# EAGLE design mbmc_single_board_cpu (EAGLE 9.5.2)
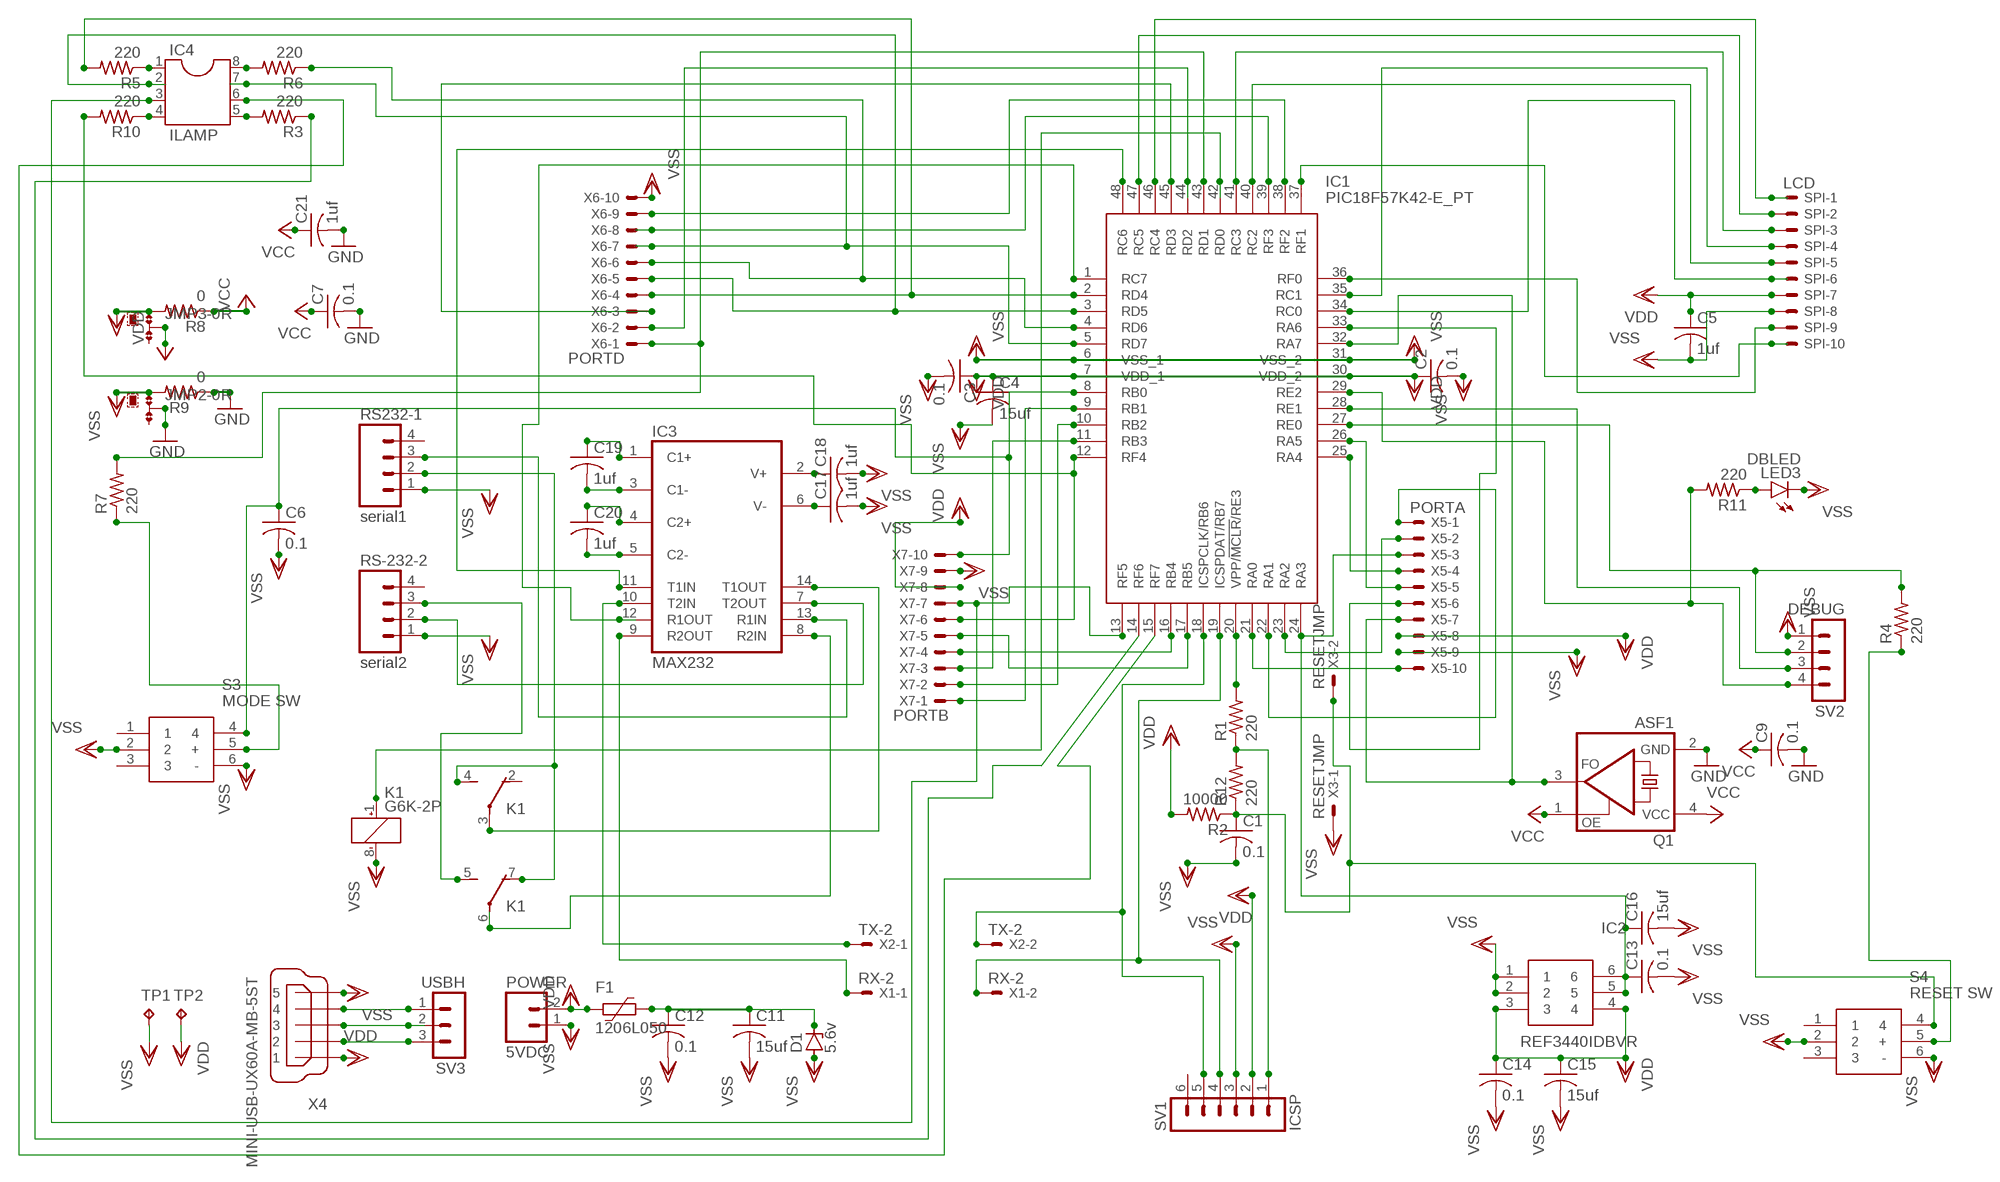
[diagram p0: schematic, sheet 1]

## Parts
C1  0.1  C-USC1206  [C1206]
C2  0.1  C-USC1206  [C1206]
C3  0.1  C-USC1206  [C1206]
C4  15uf  C-USC1206  [C1206]
C5  1uf  C-USC0805  [C0805]
C6  0.1  C-USC1206  [C1206]
C7  0.1  C-USC1206  [C1206]
C9  0.1  C-USC1206  [C1206]
C11  15uf  C-USC1206  [C1206]
C12  0.1  C-USC1206  [C1206]
C13  0.1  C-USC1206  [C1206]
C14  0.1  C-USC1206  [C1206]
C15  15uf  C-USC1206  [C1206]
C16  15uf  C-USC1206  [C1206]
C17  1uf  C-USC0805  [C0805]
C18  1uf  C-USC0805  [C0805]
C19  1uf  C-USC0805  [C0805]
C20  1uf  C-USC0805  [C0805]
C21  1uf  C-USC0805  [C0805]
D1  5.6v  ZENER-DIODEDO34-7  [DO34Z7]
F1  1206L050  [1206L]
IC1  PIC18F57K42-E_PT  [QFP50P900X900X120-48N]
IC2  REF3440IDBVR  [SOP95P280X145-6N]
IC3  MAX232  [DIL16]
IC4  ILAMP  DIL8S  [SOCKET-08]
JMP2  0R-JUMPA  [A0R-JMP]
JMP3  0R-JUMPA  [A0R-JMP]
K1  G6K-2P  [G6K-2P]
LED3  DBLED  LEDCHIPLED_1206  [CHIPLED_1206]
POWER  5VDC  M02  [02P]
Q1  ASF1  [ASF]
R1  220  R-US_R1206  [R1206]
R2  10000  R-US_R1206  [R1206]
R3  220  R-US_R1206  [R1206]
R4  220  R-US_R1206  [R1206]
R5  220  R-US_R1206  [R1206]
R6  220  R-US_R1206  [R1206]
R7  220  R-US_R1206  [R1206]
R8  0  R-US_R1206  [R1206]
R9  0  R-US_R1206  [R1206]
R10  220  R-US_R1206  [R1206]
R11  220  R-US_R1206  [R1206]
R12  220  R-US_R1206  [R1206]
RS232-1  serial1  M04  [04P]
RS-232-2  serial2  M04  [04P]
S3  MODE SW  B3W-9000-Y1N  [B3W-9_1-LED]
S4  RESET SW  B3W-9000-Y1N  [B3W-9_1-LED]
SPI  LCD  22-23-2101  [22-23-2101]
SV1  ICSP  MA06-1  [MA06-1]
SV2  DEBUG  MA04-1  [MA04-1]
SV3  USBH  MA03-1  [MA03-1]
TP1  TPB1,27  [B1,27]
TP2  TPB1,27  [B1,27]
X1  RX-2  332-02  [332-02]
X2  TX-2  332-02  [332-02]
X3  RESETJMP  332-02  [332-02]
X4  MINI-USB-UX60A-MB-5ST  [UX60A-MB-5ST]
X5  PORTA  22-23-2101  [22-23-2101]
X6  PORTD  22-23-2101  [22-23-2101]
X7  PORTB  22-23-2101  [22-23-2101]

## Nets
GND: C7.2 C9.2 C21.2 JMP2.2 Q1.2(GND) R9.1
N$1: R1.1 R12.2 SV1.1
N$2: IC1.20(VPP/!MCLR!/RE3) R1.2
N$3: IC4.1 R5.1
N$4: IC1.32(RA7) Q1.3(FO) X5.7
N$5: C17.1 IC3.6(V-)
N$6: IC1.19(ICSPDAT/RB7) SV1.4 X1.2
N$7: IC1.18(ICSPCLK/RB6) SV1.5 X2.2
N$8: C13.1 C16.1 IC1.24(RA3) IC2.5 IC2.6 X5.3
N$9: C18.1 IC3.2(V+)
N$10: C19.1 IC3.1(C1+)
N$11: C20.1 IC3.4(C2+)
N$12: C20.2 IC3.5(C2-)
N$13: C19.2 IC3.3(C1-)
N$14: K1.4(2:S) K1.7(3:O) RS232-1.2
N$15: IC3.7(T2OUT) RS-232-2.2
N$16: IC3.13(R1IN) RS232-1.3
N$17: IC4.8 R6.2
N$18: IC1.1(RC7) IC3.12(R1OUT)
N$19: IC3.9(R2OUT) X1.1
N$20: IC1.48(RC6) IC3.11(T1IN)
N$21: R4.1 S4.5(+)
N$22: IC3.10(T2IN) X2.1
N$23: IC1.27(RE0) R4.2 SV2.2
N$24: IC1.28(RE1) SV2.3
N$25: IC1.29(RE2) R11.2 SV2.4
N$26: IC3.14(T1OUT) K1.3(2:P)
N$27: IC3.8(R2IN) K1.6(3:P)
N$28: IC1.42(RD0) K1.1(1:+)
N$29: IC1.46(RC4) SPI.1
N$30: IC1.47(RC5) SPI.2
N$31: IC1.41(RC3) SPI.3
N$32: IC1.35(RC1) SPI.4
N$33: IC1.40(RC2) SPI.5
N$34: IC1.34(RC0) SPI.6
N$35: IC1.26(RA5) X5.5
N$36: IC1.25(RA4) X5.4
N$37: IC1.23(RA2) X5.2
N$38: IC1.22(RA1) X5.1
N$39: IC1.21(RA0) X5.10
N$40: IC1.33(RA6) X5.6
N$41: IC1.36(RF0) SPI.9
N$42: IC1.37(RF1) SPI.10
N$43: C6.1 IC1.8(RB0) S3.4 X7.10
N$44: IC1.44(RD2) X6.2
N$45: IC1.45(RD3) X6.3
N$46: IC1.2(RD4) R5.2 X6.4
N$47: IC1.3(RD5) IC4.2 X6.5
N$48: IC1.4(RD6) R6.1 X6.6
N$49: IC1.5(RD7) IC4.7 X6.7
N$50: IC1.38(RF2) X6.9
N$51: IC1.39(RF3) X6.8
N$52: IC1.43(RD1) R7.2 X6.1
N$53: IC1.9(RB1) X7.1
N$54: IC1.10(RB2) X7.2
N$55: IC4.5 R3.2
N$56: IC1.16(RB4) X7.4
N$57: IC1.17(RB5) X7.5
N$58: IC1.12(RF4) R10.2 X7.6
N$59: IC1.13(RF5) IC4.3 X7.7
N$60: IC1.15(RF7) IC4.6
N$61: IC1.14(RF6) R3.1
N$62: K1.5(3:S) RS-232-2.3
N$63: IC4.4 R10.1
N$64: R7.1 S3.5(+)
N$65: LED3.A R11.1
N$66: IC1.11(RB3) X7.3
N$67: SV3.1 X4.4
N$68: SV3.2 X4.3
N$69: SV3.3 X4.2
N$70: C1.1 R2.1 R12.1 S4.4 X3.2
N$71: C11.1 C12.1 D1.C F1.1
VCC: C7.1 C9.1 C21.1 JMP3.2 Q1.1(OE) Q1.4(VCC) R8.1
VDD [i-line]: C2.1 C3.1 C4.1 C5.1 C14.1 C15.1 F1.2 IC1.7(VDD_1) IC1.30(VDD_2) IC2.3 IC2.4 JMP3.1 POWER.2 R2.2 R8.2 SPI.7 SV1.2 TP2.TP X4.1 X5.8 X7.8
VSS [i-line]: C1.2 C2.2 C3.2 C4.2 C5.2 C6.2 C11.2 C12.2 C13.2 C14.2 C15.2 C16.2 C17.2 C18.2 D1.A IC1.6(VSS_1) IC1.31(VSS_2) IC2.1 IC2.2 JMP2.1 K1.8(1:-) LED3.C POWER.1 R9.2 RS232-1.1 RS-232-2.1 S3.2 S3.6(-) S4.2 S4.6(-) SPI.8 SV1.3 SV2.1 TP1.TP X3.1 X4.5 X5.9 X6.10 X7.9
Unconnected: JMP2.3 JMP3.3 K1.2(2:O) RS232-1.4 RS-232-2.4 S3.1 S3.3 S4.1 S4.3 SV1.6

## Power pins joined to a net without a drawn wire
GND: IC3.15(GND)
VCC: IC3.16(VCC)

## Library data of the parts
C1-C7 C9 C11-C21 = rcl:C-US: CAPACITOR, American symbol; SPICEPREFIX: C
D1 = diode:ZENER-DIODE: Z-Diode
F1 = polyfuse-smd_10:?: Polyfuse Resettable PTC Source: http://www.littelfuse.com/products/resettable-ptcs.aspx; MF: Littelfuse; MPN: 1206L050; OC_FARNELL: 1596993; OC_NEWARK: 53M6118
IC1 = SamacSys_Parts:PIC18F57K42-E_PT: 8-bit Microcontrollers - MCU 128KB Flash, 8KB RAM, 256B EEPROM, 12-bit ADC2, Vector Interrupts, DMA, MAP, DIA, DAC, Comp, PWM, CWG, HLT, WWDT, SCAN/CRC, ZCD, PPS, EUSART, SPI/I2C, IDLE/DOZE/PMD Source: Datasheet <https://componentsearchengine.com/Datasheets/1/PIC18F57K42-E_PT.pdf>; DESCRIPTION: 8-bit Microcontrollers - MCU 128KB Flash, 8KB RAM, 256B EEPROM, 12-bit ADC2, Vector Interrupts, DMA, MAP, DIA, DAC, Comp, PWM, CWG, HLT, WWDT, SCAN/CRC, ZCD, PPS, EUSART, SPI/I2C, IDLE/DOZE/PMD; HEIGHT: 1.2mm; MANUFACTURER_NAME: Microchip; MANUFACTURER_PART_NUMBER: PIC18F57K42-E/PT; MOUSER_PART_NUMBER: 579-PIC18F57K42-E/PT
IC2 = SamacSys_Parts:REF3440IDBVR: 4.1V Low-Drift Low-Power Small-Footprint Series Voltage Reference Source: Datasheet <http://www.ti.com/lit/gpn/ref3440>; DESCRIPTION: 4.1V Low-Drift Low-Power Small-Footprint Series Voltage Reference; HEIGHT: 1.45mm; MANUFACTURER_NAME: Texas Instruments; MANUFACTURER_PART_NUMBER: REF3440IDBVR
IC3 = maxim:MAX232: RS232 TRANSCEIVER; MF: MAXIM; MPN: MAX232ACPE+; OC_FARNELL: 9723773; OC_NEWARK: 68K4544
IC4 = ic-package:DIL8: Dual In Line / Socket
JMP2 JMP3 = jump-0r-smd:0R-JUMP: SMD 0R 0805 Jumper
K1 = relay:G6K: Low Signal Relay oeiwcsnts1.omron.com/.. D20G6K0100.pdf; MF: OMRON COMPONENTS USA; MPN: G6K-2P DC3; OC_FARNELL: 3937276; OC_NEWARK: 89C6482
LED3 = led:LED: LED OSRAM: - CHIPLED LG R971, LG N971, LY N971, LG Q971, LY Q971, LO R971, LY R971 LH N974, LH R974 LS Q976, LO Q976, LY Q976 LO Q996 - Hyper CHIPLED LW Q18S LB Q993, LB Q99A, LB R99A - SideLED LS A670, LO A670, LY A670, LG A670, LP A670 LB A673, LV A673, LT A673, LW A673 LH A674 LY A675 LS A676, LA A676, LO A676, LY A676, LW A676 LS A679, LY A679, LG A679 - Hyper Micro SIDELED® LS Y876, LA Y876, LO Y876, LY Y876 LT Y87S - SmartLED LW L88C, LW L88S LB L89C, LB L89S, LG L890 LS L89K, LO L89K, LY L89K LS L896, LA L896, LO L896, LY L896 - TOPLED LS T670, LO T670, LY T670, LG T670, LP T670 LSG T670, LSP T670, LSY T670, LOP T670, LYG T670 LG T671, LOG T671, LSG T671 LB T673, LV T673, LT T673, LW T673 LH T674 LS T676, LA T676, LO T676, LY T676, LB T676, LH T676, LSB T676, LW T676 LB T67C, LV T67C, LT T67C, LS T67K, LO T67K, LY T67K, LW E67C LS E67B, LA E67B, LO E67B, LY E67B, LB E67C, LV E67C, LT E67C LW T67C LS T679, LY T679, LG T679 LS T770, LO T770, LY T770, LG T770, LP T770 LB T773, LV T773, LT T773, LW T773 LH T774 LS E675, LA E675, LY E675, LS T675 LS T776, LA T776, LO T776, LY T776, LB T776 LHGB T686 LT T68C, LB T68C - Hyper Mini TOPLED® LB M676 - Mini TOPLED Santana® LG M470 LS M47K, LO M47K, LY M47K Source: http://www.osram.convergy.de LUXEON: - LUMILED® LXK2-PW12-R00, LXK2-PW12-S00, LXK2-PW14-U00, LXK2-PW14-V00 LXK2-PM12-R00, LXK2-PM12-S00, LXK2-PM14-U00 LXK2-PE12-Q00, LXK2-PE12-R00, LXK2-PE12-S00, LXK2-PE14-T00, LXK2-PE14-U00 LXK2-PB12-K00, LXK2-PB12-L00, LXK2-PB12-M00, LXK2-PB14-N00, LXK2-PB14-P00, LXK2-PB14-Q00 LXK2-PR12-L00, LXK2-PR12-M00, LXK2-PR14-Q00, LXK2-PR14-R00 LXK2-PD12-Q00, LXK2-PD12-R00, LXK2-PD12-S00 LXK2-PH12-R00, LXK2-PH12-S00 LXK2-PL12-P00, LXK2-PL12-Q00, LXK2-PL12-R00 Source: www.luxeon.com KINGBRIGHT: KA-3528ASYC Source: www.kingbright.com
POWER = con-amp-quick:M02: AMP QUICK CONNECTOR; OC_FARNELL: unknown; OC_NEWARK: unknown
Q1 = crystal:ASF*: CRYSTAL CLOCK OSCILLATORS 5.0 Vdc or 3.3 Vdc - LOW PROFILE ULTRA MINIATURE CERAMIC SURFACE MOUNT Source: http://www.abracon.com/Oscillators/asf1-L-L1.pdf; OC_FARNELL: unknown; OC_NEWARK: unknown
R1-R12 = rcl:R-US_: RESISTOR, American symbol; SPICEPREFIX: R
RS232-1 RS-232-2 = con-amp-quick:M04: AMP QUICK CONNECTOR; OC_FARNELL: unknown; OC_NEWARK: unknown
S3 S4 = SamacSys_Parts:B3W-9000-Y1N: Illuminated Tactile Switches Illuminated Ylw LED White Cap Source: Datasheet <http://www.mouser.com/ds/2/307/en-b3w-9-11824.pdf>; ALLIED_NUMBER: 70176005; ALLIED_PRICE-STOCK: https://www.alliedelec.com/omron-electronic-components-b3w-9000-y1n/70176005/; DESCRIPTION: Illuminated Tactile Switches Illuminated Ylw LED White Cap; HEIGHT: mm; MANUFACTURER_NAME: Omron Electronics; MANUFACTURER_PART_NUMBER: B3W-9000-Y1N; MOUSER_PART_NUMBER: 653-B3W-9000-Y1N; MOUSER_PRICE-STOCK: https://www.mouser.com/Search/Refine.aspx?Keyword=653-B3W-9000-Y1N; RS_PART_NUMBER: 0492777P; RS_PRICE-STOCK: http://uk.rs-online.com/web/p/products/0492777P
SPI X5-X7 = con-molex:22-23-2101: .100" (2.54mm) Center Header - 10 Pin; MF: MOLEX; MPN: 22-23-2101; OC_FARNELL: 1756828; OC_NEWARK: 94C0765
SV1 = con-lstb:MA06-1: PIN HEADER; OC_FARNELL: unknown; OC_NEWARK: unknown
SV2 = con-lstb:MA04-1: PIN HEADER; OC_FARNELL: unknown; OC_NEWARK: unknown
SV3 = con-lstb:MA03-1: PIN HEADER; OC_FARNELL: unknown; OC_NEWARK: unknown
TP1 TP2 = testpad:TP: Test pad
X1-X3 = con-garry:332-02: 2 Pin - 2mm Dual Row Source: www.mpe-connector.de / garry_shortform_2012.pdf
X4 = con-hirose:MINI-USB-: MINI USB Connector Source: http://www.hirose.co.jp/cataloge_hp/e24000019.pdf; OC_FARNELL: unknown; OC_NEWARK: unknown

## Net classes
1 i-line: width 0.3 mm

## Board
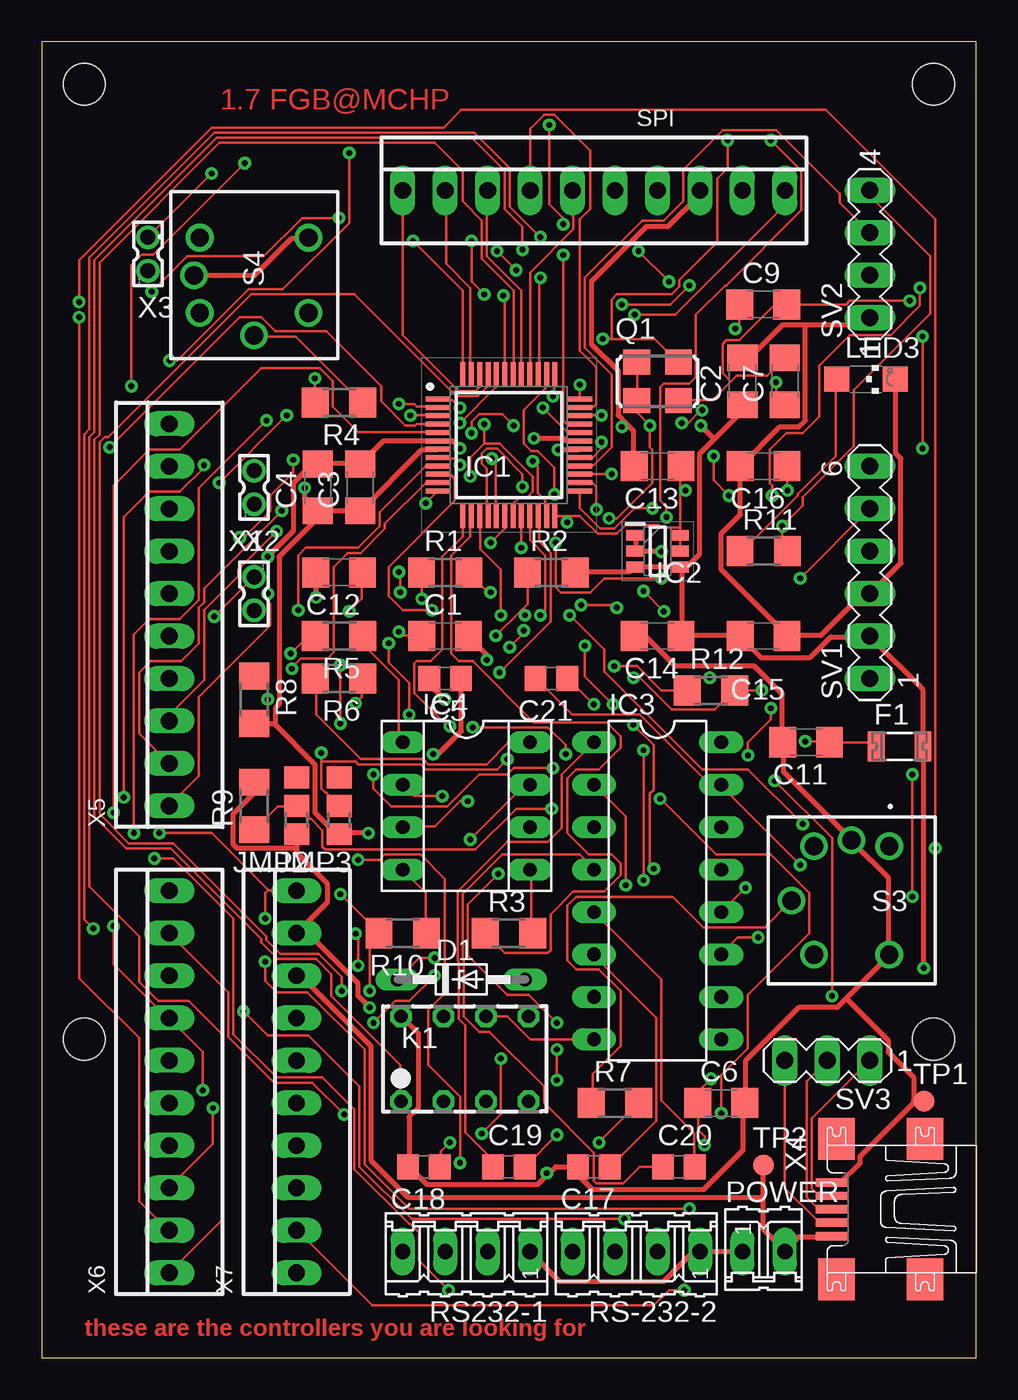
[diagram p1: board, top side]
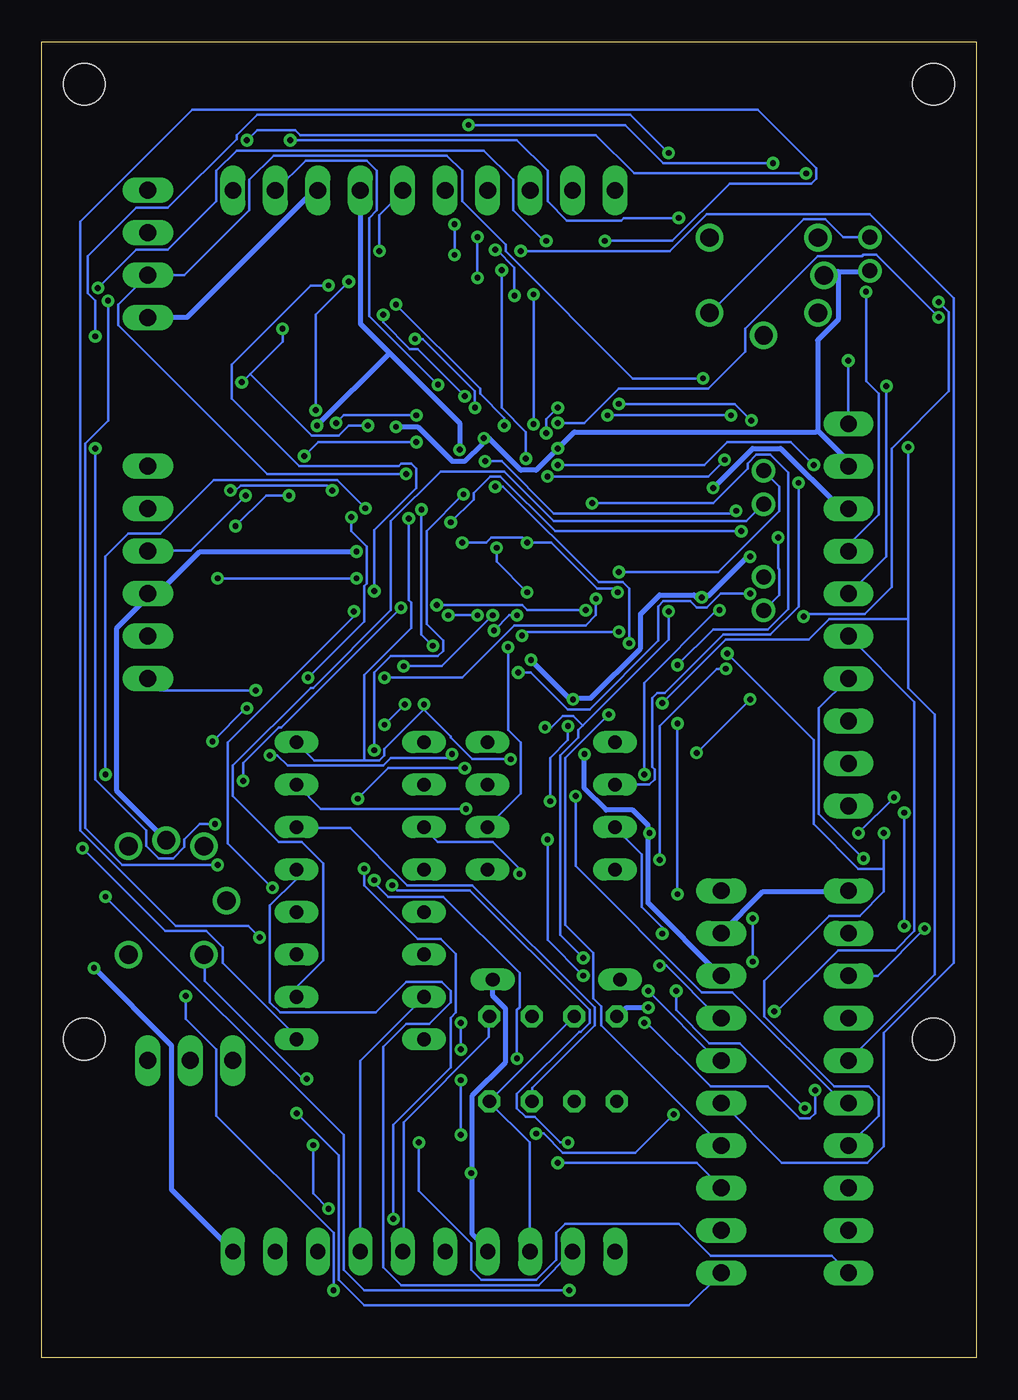
[diagram p2: board, bottom side, seen from below]

Size 55.88 x 78.74 mm. Coordinates in mm from the lower left corner, seen from the top.
Outline: 0,0 55.88,0 55.88,78.74 0,78.74 0,0
Copper layers (1*16): Top 0.035mm / dielectric 1.5mm / Bottom 0.035mm
Design rules "default": minimum track width 6mil, minimum drill 0.35mm, track to track 6mil, track to pad 6mil, pad to pad 6mil, via to via 6mil, smd to smd 6mil, copper to edge 40mil, drill to drill 6mil, minimum pad ring 10mil, minimum via ring 8mil, stop-mask expansion 4mil, vias tented up to drill 0mil, thermal gap 10mil
Holes 2.5 mm at 2.54,76.2 53.34,76.2 2.54,19.05 53.34,19.05

### Footprints (pad centres in the part's own frame; a part is rotated, then mirrored left to right if it is on the bottom)
C1206 = smd 1.6 x 1.8: 1 -1.4,0; 2 1.4,0
C0805 = smd 1.3 x 1.5: 1 -0.95,0; 2 0.95,0
DO34Z7 = drill 0.813 long: A 3.81,0; C -3.81,0
1206L = smd 1 x 1.8: 1 -1.4,0; 2 1.4,0
QFP50P900X900X120-48N = smd 1.475 x 0.3: 1 -4.238,2.75; 2 -4.238,2.25; 3 -4.238,1.75; 4 -4.238,1.25; 5 -4.238,0.75; 6 -4.238,0.25; 7 -4.238,-0.25; 8 -4.238,-0.75; 9 -4.238,-1.25; 10 -4.238,-1.75; 11 -4.238,-2.25; 12 -4.238,-2.75; 25 4.238,-2.75; 26 4.238,-2.25; 27 4.238,-1.75; 28 4.238,-1.25; 29 4.238,-0.75; 30 4.238,-0.25; 31 4.238,0.25; 32 4.238,0.75; 33 4.238,1.25; 34 4.238,1.75; 35 4.238,2.25; 36 4.238,2.75 | smd 0.3 x 1.475: 13 -2.75,-4.238; 14 -2.25,-4.238; 15 -1.75,-4.238; 16 -1.25,-4.238; 17 -0.75,-4.238; 18 -0.25,-4.238; 19 0.25,-4.238; 20 0.75,-4.238; 21 1.25,-4.238; 22 1.75,-4.238; 23 2.25,-4.238; 24 2.75,-4.238; 37 2.75,4.238; 38 2.25,4.238; 39 1.75,4.238; 40 1.25,4.238; 41 0.75,4.238; 42 0.25,4.238; 43 -0.25,4.238; 44 -0.75,4.238; 45 -1.25,4.238; 46 -1.75,4.238; 47 -2.25,4.238; 48 -2.75,4.238
SOP95P280X145-6N = smd 1.075 x 0.65: 1 -1.338,0.95; 2 -1.338,0; 3 -1.338,-0.95; 4 1.338,-0.95; 5 1.338,0; 6 1.338,0.95
DIL16 = drill 0.813 long: 1 -8.89,-3.81; 2 -6.35,-3.81; 3 -3.81,-3.81; 4 -1.27,-3.81; 5 1.27,-3.81; 6 3.81,-3.81; 7 6.35,-3.81; 8 8.89,-3.81; 9 8.89,3.81; 10 6.35,3.81; 11 3.81,3.81; 12 1.27,3.81; 13 -1.27,3.81; 14 -3.81,3.81; 15 -6.35,3.81; 16 -8.89,3.81
SOCKET-08 = drill 0.813 long: 1 -3.81,-3.81; 2 -1.27,-3.81; 3 1.27,-3.81; 4 3.81,-3.81; 5 3.81,3.81; 6 1.27,3.81; 7 -1.27,3.81; 8 -3.81,3.81
A0R-JMP = smd 1.5 x 1.3: 1 0,1.7; 2 0,0; 3 0,-1.7
G6K-2P = drill 0.8 octagon: 1 -2.54,-2.54; 2 0,-2.54; 3 2.54,-2.54; 4 5.08,-2.54; 5 5.08,2.54; 6 2.54,2.54; 7 0,2.54; 8 -2.54,2.54
CHIPLED_1206 = smd 1.5 x 1.5: A 0,-1.75; C 0,1.75
02P = drill 0.914 long: 1 -1.27,0; 2 1.27,0
ASF = smd 1.6 x 1.5: 1 -1.25,-1.15; 2 1.25,-1.15; 3 1.25,1.15; 4 -1.25,1.15
R1206 = smd 1.6 x 1.803: 1 -1.422,0; 2 1.422,0
04P = drill 0.914 long: 1 -3.81,0; 2 -1.27,0; 3 1.27,0; 4 3.81,0
B3W-9_1-LED = drill 1.1 pad 1.65: 1 3.25,-2.25; 2 -3.25,-2.25; 3 3.25,2.25; 4 -3.25,2.25; 5 0,3.6; 6 3.6,0
22-23-2101 = drill 1 long: 1 -11.43,0; 2 -8.89,0; 3 -6.35,0; 4 -3.81,0; 5 -1.27,0; 6 1.27,0; 7 3.81,0; 8 6.35,0; 9 8.89,0; 10 11.43,0
MA06-1 = drill 1.016 long: 1 -6.35,0; 2 -3.81,0; 3 -1.27,0; 4 1.27,0; 5 3.81,0; 6 6.35,0
MA04-1 = drill 1.016 long: 1 -3.81,0; 2 -1.27,0; 3 1.27,0; 4 3.81,0
MA03-1 = drill 1.016 long: 1 -2.54,0; 2 0,0; 3 2.54,0
B1,27 = smd 1.27 x 1.27: TP 0,0
332-02 = drill 0.9 pad 1.27: 1 0,-1; 2 0,1
UX60A-MB-5ST = smd 2 x 0.5: 1 2.25,1.6; 2 2.25,0.8; 3 2.25,0; 4 2.25,-0.8; 5 2.25,-1.6 | smd 2.2 x 2.5: M1 -3.3,-4.2; M2 -3.3,4.2; M3 2,4.2; M4 2,-4.2

### Placement (x,y rotation side)
C1  24.13,43.18 0 top
C2  41.91,58.42 90 top
C3  19.05,52.07 90 top
C4  16.51,52.07 90 top
C5  24.13,40.64 180 top
C6  40.64,15.24 0 top
C7  44.45,58.42 90 top
C9  43.15,63.02 0 top
C11  45.72,36.83 180 top
C12  17.78,46.99 180 top
C13  36.83,53.34 180 top
C14  36.83,43.18 180 top
C15  43.18,43.18 0 top
C16  43.18,53.34 180 top
C17  33.02,11.43 180 top
C18  22.86,11.43 180 top
C19  27.94,11.43 0 top
C20  38.1,11.43 0 top
C21  30.48,40.64 180 top
D1  25.1,22.63 0 top
F1  51.31,36.58 0 top
IC1  27.94,54.61 0 top
IC2  36.83,48.26 0 top
IC3  36.83,27.94 270 top
IC4  25.4,33.02 270 top
JMP2  15.24,33.02 180 top
JMP3  17.78,33.02 180 top
K1  24.03,17.88 0 top
LED3  49.3,58.55 270 top
POWER  43.18,6.35 0 top
Q1  36.83,58.42 0 top
R1  24.13,46.99 0 top
R2  30.48,46.99 0 top
R3  27.94,25.4 0 top
R4  17.78,57.15 180 top
R5  17.78,43.18 180 top
R6  17.78,40.64 180 top
R7  34.29,15.24 0 top
R8  12.7,39.37 270 top
R9  12.7,33.02 90 top
R10  21.59,25.4 180 top
R11  43.18,48.26 0 top
R12  40.03,39.93 0 top
RS232-1  25.4,6.35 180 top
RS-232-2  35.56,6.35 180 top
S3  48.44,27.36 90 top
S4  12.7,64.77 180 top
SPI  33.02,69.85 0 top
SV1  49.53,46.99 90 top
SV2  49.53,66.04 90 top
SV3  46.99,17.78 180 top
TP1  52.76,15.34 0 top
TP2  43.15,11.53 0 top
X1  12.7,45.72 180 top
X2  12.7,52.07 0 top
X3  6.35,66.04 0 top
X4  49.53,8.89 180 top
X5  7.62,44.45 90 top
X6  7.62,16.51 90 top
X7  15.24,16.51 90 top

### Tracks (layer width: path | path; a pad name or v marks a point on that pad's centre or on a via)
GND  (via drill 0.35)
  Top 0.152: 41.21,58.41 41.55,58.75 43.38,58.75 C7.2 | 41.21,58.41 40.11,57.3 38.12,57.3 Q1.2 | 41.21,58.41 40.72,58.9 40.72,60.66 40.95,60.88 41.71,60.88 43.84,63.02 C9.2 48.11,63.02 48.34,63.25 v51.92,63.25 | R9.1 12.75,31.62 14.12,32.99 15.19,32.99 JMP2.2 16.03,32.23 16.1,32.23 16.79,31.55 16.79,30.56 16.94,30.4 25.93,30.4 28.37,32.84 v30.5,32.84 | 40.56,34.29 39.95,34.29 35.76,38.48 31.72,38.48 29.59,40.62 C21.2 | 40.56,34.29 v45.36,29.49 | 40.56,34.29 IC3.15
  Bottom 0.152: v30.5,32.84 39.19,32.84 IC3.15 | v51.92,63.25 51.92,56.08 53.29,54.71 53.29,31.7 51.08,29.49 v45.36,29.49
N$1  (via drill 0.35)
  Top 0.152: v43.08,39.93 R12.2 41.4,39.93 40.26,38.79 37.67,38.79 35.76,40.69 v35.38,40.69 | v22.73,45.41 22.73,46.94 R1.1
  Bottom 0.152: v43.08,39.93 48.79,39.93 49.48,40.62 SV1.1 | v22.73,45.41 22.73,44.43 23.34,43.82 27.61,43.82 30.73,40.69 v35.38,40.69
N$2  (via drill 0.35)
  Top 0.152: v28.68,48.46 28.68,50.37 IC1.20 | v26.85,45.8 26.7,45.8 25.55,46.94 R1.2
  Bottom 0.152: v28.68,48.46 28.68,47.62 v26.85,45.8
N$3
  Top 0.152: R5.1 19.23,43.13 19.23,42.67 21.36,40.54 21.36,37.11 21.59,36.88 IC4.1
N$4  (via drill 0.35)
  Top 0.152: v29.97,56.84 31.42,55.4 32.11,55.4 IC1.32 | 34.09,60.96 36.68,60.96 38.05,59.59 Q1.3 | 34.09,60.96 v33.55,60.96 | v6.58,63.78 8.71,65.91 13.28,65.91 15.57,68.2 v17.78,68.2 | v41.02,72.85 41.02,71.17 40.41,70.56 40.41,66.75 38.12,64.47 38.12,64.08 37.67,63.63 34.39,63.63 34.09,63.32 34.09,60.96
  Bottom 0.152: v29.97,56.84 29.97,57.84 33.1,60.96 v33.55,60.96 | v6.58,63.78 6.58,58.45 5.82,57.68 5.82,50.44 7.57,48.69 7.57,48.31 X5.7 | v17.78,68.2 21.06,68.2 21.21,68.05 24.49,68.05 25.63,69.19 25.63,71.02 27.46,72.85 v41.02,72.85
N$5
  Top 0.152: C17.1 34.01,11.43 36.75,14.17 36.75,20.34 33.02,24.08 IC3.6
N$6  (via drill 0.35)
  Top 0.152: 26.47,54.71 27.38,54.71 29.36,52.73 29.36,51.82 29.06,51.51 28.6,51.51 28.22,51.13 28.22,50.44 IC1.19 | 26.47,54.71 25.63,53.87 v25.63,52.73 | v15.04,53.72 15.04,52.96 13.67,51.59 13.67,50.67 12.07,49.07 v11.84,49.07 | v43.69,51.59 43.69,52.2 43.54,52.35 43.54,54.33 44.53,55.32 45.52,55.32 46.51,56.31 46.51,59.36 48.34,61.19 50.78,61.19 52.53,62.94 v52.53,64.01 | v25.71,66.83 25.71,64.39 v26.47,63.63 | 26.47,54.71 v26.47,55.86
  Bottom 0.152: v25.63,52.73 16.03,52.73 v15.04,53.72 | v11.84,49.07 11.84,47.24 11.76,47.17 11.76,45.64 12.68,44.73 X1.2 | v43.69,51.59 46.97,48.31 49.48,48.31 SV1.4 | v52.53,64.01 50.24,66.29 48.34,66.29 45.44,69.19 45.44,71.02 44.22,72.24 29.44,72.24 27.69,70.48 27.69,68.66 25.86,66.83 v25.71,66.83 | v26.47,55.86 v26.47,63.63
N$7  (via drill 0.35)
  Top 0.152: v26.85,48.77 27.69,49.61 IC1.18 | v21.44,45.8 21.44,46.94 v21.36,47.02 | v45.36,46.63 SV1.5 | v37.06,46.63 33.63,46.63 32.79,45.8 31.04,45.8 30.73,46.1 v30.73,48.77
  Bottom 0.152: v21.44,45.8 21.67,46.03 22.66,46.03 25.4,48.77 v26.85,48.77 27.15,49.07 28.98,49.07 29.29,48.77 v30.73,48.77 | v21.36,47.02 15.42,47.02 11.76,50.67 11.76,52.12 12.68,53.04 X2.2 | v37.06,46.63 v45.36,46.63
N$8  (via drill 0.35)
  Top 0.152: IC2.5 38.2,48.31 38.2,49.15 IC2.6 38.2,49.23 38.2,49.68 | 38.2,51.89 38.2,53.34 C13.1 | 38.2,51.89 38.2,49.68 | 31.42,50.37 32.18,50.37 33.25,49.3 34.39,49.3 34.92,49.84 36.91,49.84 37.06,49.68 38.2,49.68 | 31.42,50.37 30.73,50.37 IC1.24 | v44.6,51.89 44.6,53.34 C16.1 | 38.2,51.89 v38.51,51.89 | v14.05,49.45 11.76,47.17 11.76,46.79 9.7,44.73 9.7,40.54 7.64,38.48 7.64,38.1 X5.3 | 31.42,50.37 v31.42,49.99
  Bottom 0.152: v44.6,51.89 44.3,51.89 43.99,52.2 38.81,52.2 v38.51,51.89 | v14.05,49.45 25.17,49.45 28.45,52.73 29.06,52.73 30.05,51.74 30.05,51.36 v31.42,49.99
N$9  (via drill 0.35)
  Top 0.152: v24.41,12.88 23.88,12.34 23.88,11.43 C18.1 | v34.92,28.27 34.92,32.38 IC3.2
  Bottom 0.152: v24.41,12.88 24.87,12.88 26.39,14.4 26.92,14.4 27.46,14.94 27.46,15.77 23.72,19.51 23.65,19.51 23.11,20.04 23.11,20.8 30.28,27.96 34.62,27.96 v34.92,28.27
N$10
  Top 0.152: C19.1 26.92,11.43 26.92,11.89 25.32,13.49 25.32,19.89 24.94,20.27 24.94,23.7 24.87,23.77 24.87,27.89 27.84,30.86 30.28,30.86 31.11,31.7 31.11,34.9 33.02,36.8 IC3.1
N$11
  Top 0.152: C20.1 35.76,11.43 34.77,10.44 33.17,10.44 33.02,10.59 33.02,12.27 30.05,15.24 30.05,16.23 26.77,19.51 26.16,19.51 25.25,20.42 25.25,23.85 25.17,23.93 25.17,27.74 27.53,30.1 32.18,30.1 33.02,29.26 IC3.4
N$12
  Top 0.152: IC3.5 37.06,22.63 37.06,15.39 39.04,13.41 C20.2
N$13  (via drill 0.35)
  Top 0.152: v30.81,13.34 28.9,11.43 C19.2 | v30.81,18.44 v30.81,16.61 | v30.81,20.04 29.13,21.72 27.84,21.72 25.48,24.08 25.48,27.13 v27.31,28.96
  Bottom 0.152: v30.81,16.61 v30.81,13.34 | v30.81,20.04 v30.81,18.44 | v27.31,28.96 27.31,29.26 28.9,30.86 32.18,30.86 33.02,31.7 IC3.3
N$14
  Bottom 0.152: K1.7 K1.4 29.13,15.32 26.7,12.88 26.7,6.4 RS232-1.2
N$15
  Bottom 0.152: RS-232-2.2 36.83,17.75 33.02,21.56 IC3.7
N$16
  Bottom 0.152: IC3.13 40.64,28.65 42.24,27.05 42.24,21.26 41.63,20.65 35.92,20.65 34.09,22.48 31.95,22.48 31.42,21.95 31.42,21.26 32.72,19.96 34.09,19.96 35.46,18.59 35.46,5.41 34.39,4.34 26.16,4.34 24.18,6.33 RS232-1.3
N$17
  Top 0.152: R6.2 16.41,40.62 16.41,38.48 19.07,35.81 22.81,35.81 23.11,35.51 26.62,35.51 27.92,36.8 29.21,36.8 IC4.8
N$18  (via drill 0.35)
  Top 0.152: v25.02,56.84 24.56,57.3 23.72,57.3 IC1.1 | v25.71,55.32 25.71,56.01 26.16,56.46 27.53,56.46 v28.22,55.78 | v34.7,63.02 37.59,63.02 v38.73,64.16 | v37.21,44.65 v35.99,45.87 | IC3.12 v42.09,28.12
  Bottom 0.152: v25.02,56.84 25.71,56.16 v25.71,55.32 | v28.22,55.78 28.22,56.24 29.67,57.68 29.67,57.99 v34.7,63.02 | v38.73,64.16 39.8,64.16 44.53,59.44 44.53,57.38 40.49,53.34 34.54,53.34 34.39,53.49 33.78,53.49 33.48,53.19 33.48,52.05 35.99,49.53 v35.99,45.87 | v37.21,44.65 37.21,44.35 44.76,36.8 44.76,30.79 v42.09,28.12
N$19  (via drill 0.35)
  Top 0.152: v53.44,30.48 53.44,68.12 46.89,74.68 25.1,74.68 24.03,73.61 10.16,73.61 2.23,65.68 v2.23,63.17 | v10.31,44.35 12.68,46.71 X1.1
  Bottom 0.152: IC3.9 40.64,19.2 45.06,23.62 45.06,24.54 46.05,25.53 48.49,25.53 v53.44,30.48 | v2.23,63.17 1.63,62.56 1.63,57.84 5.05,54.41 5.05,46.1 6.66,44.5 10.16,44.5 v10.31,44.35
N$20  (via drill 0.35)
  Top 0.152: v22.2,66.83 25.17,63.86 25.17,58.9 IC1.48 | v42.85,25.15 41.63,25.15 40.64,24.15 IC3.11
  Bottom 0.152: v22.2,66.83 18.16,66.83 14.73,70.26 9.86,70.26 9.55,70.56 9.55,71.17 13.06,74.68 46.89,74.68 53.59,67.97 53.59,31.55 47.88,25.83 43.54,25.83 v42.85,25.15
N$21
  Top 0.152: R4.1 19.15,57.15 15.19,61.11 12.75,61.11 S4.5
N$22
  Bottom 0.152: IC3.10 40.64,22.17 39.04,23.77 39.04,29.57 40.34,30.86 41.71,30.86 44.45,33.6 44.45,35.43 39.8,40.08 39.65,40.08 35,44.73 35,50.06 32.03,53.04 28.22,53.04 25.25,50.06 13.74,50.06 12.75,51.05 X2.1
N$23  (via drill 0.35)
  Top 0.152: v34.09,52.88 32.18,52.88 IC1.27 | v16.33,58.6 16.33,57.15 R4.2
  Bottom 0.152: v34.09,52.88 42.39,52.88 51.31,61.8 51.31,63.02 49.56,64.77 SV2.2 47.35,64.77 43.46,68.66 43.46,70.48 42.01,71.93 31.65,71.93 30.73,71.02 30.73,69.19 28.14,66.6 28.14,66.22 20.52,58.6 v16.33,58.6
N$24
  Top 0.152: SV2.3 47.73,69.11 47.73,69.65 43.92,73.46 40.72,73.46 38.35,71.09 38.35,69.19 37.21,68.05 35.92,68.05 32.49,64.62 32.49,60.43 34.09,58.83 34.09,54.48 33.02,53.42 32.18,53.42 IC1.28
N$25  (via drill 0.35)
  Top 0.152: v33.48,54.79 33.48,54.41 32.94,53.87 32.18,53.87 IC1.29 | v40.18,53.95 40.18,52.5 v41.1,51.59 | R11.2 44.53,48.31 44.3,48.54 v44.3,49.76 45.52,50.98 45.52,51.51 48.56,54.56 48.56,57.91 53.14,62.48 53.14,65.91 49.56,69.49 49.56,69.8 SV2.4
  Bottom 0.152: v33.48,54.79 39.34,54.79 v40.18,53.95 | v41.1,51.59 42.47,51.59 v44.3,49.76
N$26
  Bottom 0.152: K1.3 26.54,15.39 26.54,16.15 22.81,19.89 22.81,20.95 30.12,28.27 34.01,28.27 37.44,31.7 40.64,31.7 IC3.14
N$27
  Top 0.152: K1.6 27.84,20.42 29.21,19.05 IC3.8
N$28
  Top 0.152: IC1.42 28.22,58.9 28.22,63.86 26.31,65.76 26.31,68.05 25.17,69.19 25.17,71.02 23.5,72.7 10.62,72.7 3.45,65.53 3.45,55.25 3.15,54.94 3.15,32.38 5.05,30.48 7.72,30.48 13.13,25.07 13.13,24.84 14.12,23.85 16.41,23.85 17.32,22.94 17.32,21.64 21.44,17.53 21.44,15.39 K1.1
N$29
  Top 0.152: SPI.1 21.59,61.19 24.94,57.84 25.93,57.84 26.16,58.06 26.16,58.83 IC1.46
N$30
  Top 0.152: IC1.47 25.63,58.9 25.63,64.01 24.18,65.46 24.18,69.8 SPI.2
N$31
  Top 0.152: IC1.41 28.68,58.9 28.68,63.86 26.62,65.91 26.62,69.8 SPI.3
N$32
  Top 0.152: SPI.4 29.21,73.53 30.05,74.37 30.66,74.37 32.79,72.24 32.79,68.73 32.18,68.12 32.18,60.27 33.17,59.28 33.17,57.07 33.02,56.92 32.18,56.92 IC1.35
N$33
  Top 0.152: IC1.40 29.21,58.9 29.21,64.92 31.8,67.51 31.8,69.8 SPI.5
N$34  (via drill 0.35)
  Top 0.152: v33.48,56.39 32.18,56.39 IC1.34 | v38.28,55.93 38.66,55.93 39.42,56.69 v39.5,56.69 | v35.69,66.22 v37.52,64.39
  Bottom 0.152: v33.48,56.39 37.82,56.39 v38.28,55.93 | v39.5,56.69 39.5,62.41 v37.52,64.39 | v35.69,66.22 35.69,68.35 34.24,69.8 SPI.6
N$35  (via drill 0.35)
  Top 0.152: v33.17,50.75 33.17,52.12 32.94,52.35 IC1.26 | v32.49,42.6 32.49,40.77 v34.16,39.09 | v35.38,37.87 36.6,36.65 36.6,33.98 36.37,33.76 36.37,29.49 v36.6,29.26 | v34.85,8.31 22.12,8.31 19,11.43 19,16.23 15.95,19.28 13.51,19.28 v12.07,20.73
  Bottom 0.152: v33.17,50.75 33.17,43.28 v32.49,42.6 | v35.38,37.87 v34.16,39.09 | v36.6,29.26 36.6,28.27 33.4,25.07 32.03,25.07 31.11,24.15 31.11,20.65 31.42,20.34 31.42,17.37 34.85,13.95 v34.85,8.31 | v12.07,20.73 11.91,20.73 8.25,24.38 4.83,24.38 3.68,25.53 3.68,39.24 X5.5
N$36  (via drill 0.35)
  Top 0.152: v36.53,50.83 35.46,50.83 34.24,49.61 33.4,49.61 32.18,50.83 32.18,51.82 IC1.25 | v52.07,27.58 v52.07,34.9 | v24.33,4.04 22.58,5.79 22.58,7.47 22.05,8 21.97,8 18.69,11.28 18.69,14.86 16.79,16.76 14.05,16.76 11.46,19.36 11.46,26.29 7.87,29.87 v6.73,29.87
  Bottom 0.152: v36.53,50.83 38.2,52.5 45.59,52.5 48.79,49.3 50.7,49.3 52.07,47.93 v52.07,34.9 | v52.07,27.58 37.82,13.34 37.82,5.26 36.6,4.04 v24.33,4.04 | v6.73,29.87 9.4,32.54 9.4,38.86 X5.4
N$37  (via drill 0.35)
  Top 0.152: v29.36,53.65 29.67,53.34 29.67,51.74 30.12,51.28 30.12,50.44 IC1.23 | v14.35,50.67 9.7,46.03 9.7,45.19 9.4,44.88 9.4,42.75 8.33,41.68 6.5,41.68 5.82,41 5.82,37.34 7.57,35.59 X5.2
  Bottom 0.152: v29.36,53.65 28.37,53.65 25.25,50.52 14.5,50.52 v14.35,50.67
N$38  (via drill 0.35)
  Top 0.152: v27.38,41 30.43,44.04 30.43,48.16 29.74,48.84 29.74,50.37 IC1.22 | v13.51,45.72 13.51,45.26 13.67,45.11 13.67,43.82 9.4,39.55 9.4,34.82 7.64,33.07 X5.1
  Bottom 0.152: v27.38,41 26.62,41 24.41,38.79 23.11,38.79 19,42.9 19,44.96 18.69,45.26 17.09,45.26 16.71,44.88 16.1,44.88 15.27,45.72 v13.51,45.72
N$39  (via drill 0.35)
  Top 0.152: v29.82,44.43 30.12,44.73 30.12,48.01 29.21,48.92 29.21,50.37 IC1.21 | v31.57,44.43 33.63,42.37 33.63,41.07 39.5,35.2 42.24,35.2 v45.52,31.93 | v52.68,61.11 v52.68,54.41 | v18.39,72.09 18.39,67.89 14.43,63.93 12.37,63.93 8.1,59.66 v7.64,59.66
  Bottom 0.152: v31.57,44.43 v29.82,44.43 | v45.52,31.93 46.43,31.93 47.35,31.01 47.35,30.56 48.03,29.87 48.87,29.87 49.63,30.63 49.63,31.55 52.68,34.59 v52.68,54.41 | v52.68,61.11 52.68,63.25 53.14,63.7 53.14,65.91 50.24,68.81 48.34,68.81 44.22,72.92 44.22,73.15 43,74.37 20.68,74.37 v18.39,72.09 | v7.64,59.66 7.64,55.93 X5.10
N$40  (via drill 0.35)
  Top 0.152: v31.19,65.99 31.19,56.08 31.34,55.93 32.11,55.93 IC1.33 | v31.19,67.82 31.19,68.2 30.35,69.04 v30.35,73.76 | v12.14,71.48 6.66,65.99 5.97,65.99 5.36,65.38 v5.36,58.14
  Bottom 0.152: v31.19,67.82 v31.19,65.99 | v30.35,73.76 20.98,73.76 18.69,71.48 v12.14,71.48 | v5.36,58.14 5.36,47.93 7.57,45.72 X5.6
N$41  (via drill 0.35)
  Top 0.152: v32.18,58.22 32.18,57.38 IC1.36
  Bottom 0.152: v32.18,58.22 36.3,62.33 36.3,68.2 35.84,68.66 35.84,71.02 36.45,71.63 40.11,71.63 41.86,69.88 SPI.9
N$42  (via drill 0.35)
  Top 0.152: v30.58,57.53 30.66,57.61 30.66,58.83 IC1.37 | v35.46,62.41 37.9,62.41 44.45,68.96 SPI.10
  Bottom 0.152: v30.58,57.53 33.4,60.35 33.86,60.35 35.46,61.95 v35.46,62.41
N$43  (via drill 0.35)
  Top 0.152: 39.27,15.24 39.27,15.93 v40.03,16.69 | v25.02,53.42 24.64,53.8 23.72,53.8 IC1.8 | v9.7,53.42 9.7,53.26 8.25,51.82 6.43,51.82 4.9,50.29 v4.9,33.53 | v7.04,31.39 10.16,31.39 13.55,28 | 13.55,28 13.59,27.96 15.19,27.96 X7.10 | 39.27,15.24 39.27,13.64 39.65,13.26 v39.65,12.72 | v38.73,8.92 21.97,8.92 19.3,11.58 19.3,18.44 15.88,21.87 14.05,21.87 13.36,22.55 v13.36,23.7 | v13.36,26.29 13.36,27.81 13.55,28 | 39.27,15.24 C6.1
  Bottom 0.152: v40.03,16.69 40.26,16.69 46.13,22.55 46.13,24.08 S3.4 | v25.02,53.42 16.26,53.42 14.88,54.79 11.07,54.79 v9.7,53.42 | v7.04,31.39 v4.9,33.53 | v39.65,12.72 39.65,9.83 v38.73,8.92 | v13.36,26.29 v13.36,23.7
N$44  (via drill 0.35)
  Top 0.152: v25.02,55.93 27.15,58.06 27.15,58.83 IC1.44 | v2.23,62.26 2.23,22.71 5.82,19.13 5.82,9.37 7.57,7.62 X6.2
  Bottom 0.152: v25.02,55.93 23.42,55.93 21.36,57.99 16.03,57.99 13.82,60.2 13.82,61.57 9.47,65.91 6.81,65.91 6.73,65.99 5.97,65.99 v2.23,62.26
N$45  (via drill 0.35)
  Top 0.152: v17.93,21.95 17.93,22.78 16.56,24.15 14.28,24.15 13.44,24.99 13.44,25.22 7.87,30.79 5.21,30.79 3.45,32.54 3.45,54.79 3.76,55.09 3.99,55.09 12.52,63.63 18.69,63.63 24.79,57.53 26.09,57.53 26.62,58.06 26.62,58.83 IC1.45 | v10.24,14.94 10.24,12.8 7.64,10.21 X6.3
  Bottom 0.152: v17.93,21.95 17.93,20.8 15.95,18.82 14.12,18.82 v10.24,14.94
N$46  (via drill 0.35)
  Top 0.152: v21.36,57.07 22.28,57.07 22.43,56.92 23.65,56.92 IC1.2 | v13.44,56.08 9.4,52.05 9.4,45.34 8.25,44.2 6.43,44.2 5.51,43.28 v5.51,31.39 | v14.88,42.14 15.88,43.13 16.33,43.13 R5.2
  Bottom 0.152: v21.36,57.07 14.43,57.07 v13.44,56.08 | 5.51,29.26 5.51,27.89 6.96,26.44 8.79,26.44 12.68,22.55 12.68,20.42 8.48,16.23 6.43,16.23 5.82,15.62 5.82,14.48 7.57,12.72 X6.4 | 5.51,29.26 v5.51,31.39 | v14.88,42.14 9.7,36.96 9.7,31.93 7.04,29.26 5.51,29.26
N$47  (via drill 0.35)
  Top 0.152: v22.05,56.39 23.65,56.39 IC1.3 | v10.62,52.35 v14.66,56.39 | v23.95,33.6 22.28,33.6 IC4.2
  Bottom 0.152: v14.66,56.39 v22.05,56.39 | v10.62,52.35 10.62,44.96 12.29,43.28 15.11,43.28 18.62,39.78 19.07,39.78 19.38,39.47 19.38,35.36 19.23,35.2 19.23,34.59 19.53,34.29 IC4.2 | X6.5 7.95,15.24 14.58,21.87 16.41,21.87 23.95,29.41 v23.95,33.6
N$48  (via drill 0.35)
  Top 0.152: v4.06,54.48 11.84,62.26 13.13,62.26 13.97,61.42 17.02,61.42 20.29,58.14 20.29,57.23 21.74,55.78 22.35,55.78 22.43,55.86 23.65,55.86 IC1.4 | v18.77,39.17 19.15,39.55 19.15,40.62 R6.1
  Bottom 0.152: 4.06,44.2 4.06,40.08 2.46,38.48 2.46,22.94 X6.6 | 4.06,44.2 v4.06,54.48 | v18.77,39.17 14.96,42.98 10.01,42.98 8.79,44.2 4.06,44.2
N$49  (via drill 0.35)
  Top 0.152: v4.29,32.61 4.29,52.2 6.43,54.33 8.25,54.33 13.13,59.21 16.64,59.21 17.4,58.45 17.4,56.92 18.92,55.4 23.65,55.4 IC1.5 | v4.29,25.83 4.29,23.55 7.57,20.27 X6.7 7.64,20.27 9.63,18.29 v9.63,16 | IC4.7 28.9,34.29 v25.63,31.01 | v23.5,22.86 21.97,21.34 21.13,21.34 v19.84,20.04
  Bottom 0.152: v4.29,25.83 v4.29,32.61 | v25.63,31.01 25.63,24.99 v23.5,22.86 | v19.84,20.04 19.68,20.04 15.88,16.23 12.45,16.23 10.54,14.33 9.93,14.33 9.63,14.63 v9.63,16
N$50  (via drill 0.35)
  Top 0.152: v30.66,51.66 30.66,53.26 29.67,54.25 29.29,54.25 28.83,54.71 28.83,56.69 30.12,57.99 30.12,58.83 IC1.38 | v35.99,28.57 v35.99,36.35 | v27.46,17.91 27.46,14.55 v26.31,13.41 | v18.09,14.55 16.18,16.46 13.89,16.46 11.15,19.2 11.15,21.87 X6.9
  Bottom 0.152: v30.66,51.66 32.87,49.45 32.87,43.89 31.88,42.9 31.88,42.29 32.18,41.99 35,41.99 35.99,41 v35.99,36.35 | v35.99,28.57 35.99,28.42 35.15,27.58 31.88,27.58 27.31,23.01 27.31,20.95 27.46,20.8 v27.46,17.91 | v26.31,13.41 25.86,13.41 24.71,12.27 20.37,12.27 v18.09,14.55
N$51  (via drill 0.35)
  Top 0.152: v29.82,64.62 29.74,64.54 29.74,58.9 IC1.39 | v29.82,67.06 27.99,68.89 27.99,71.17 25.86,73.3 10.31,73.3 2.85,65.84 2.85,55.55 2.54,55.25 2.54,26.21 v3.07,25.68
  Bottom 0.152: v29.82,67.06 v29.82,64.62 | v3.07,25.68 5.89,22.86 X6.8
N$52  (via drill 0.35)
  Top 0.152: v27.61,63.55 27.69,63.48 27.69,58.9 IC1.43 | v28.75,66.29 28.75,67.67 27.69,68.73 27.69,71.02 25.71,73 10.46,73 3.15,65.68 3.15,55.4 2.85,55.09 2.85,28.19 5.82,25.22 5.82,22.48 6.96,21.34 8.79,21.34 10.85,19.28 10.85,8.31 X6.1 | v33.33,12.88 35.69,15.24 R7.2
  Bottom 0.152: v27.61,63.55 27.61,65.23 28.68,66.29 v28.75,66.29 | v33.33,12.88 33.33,9.98 30.2,6.86 30.2,5.26 29.59,4.65 26.31,4.65 25.1,5.87 25.1,7.47 24.56,8 17.78,8 15.88,6.1 8.64,6.1 X6.1
N$53  (via drill 0.35)
  Top 0.152: v15.34,44.73 15.34,48.01 15.8,48.46 18.92,48.46 20.22,49.76 20.22,50.6 22.96,53.34 23.65,53.34 IC1.9 | v19.84,34.9 19.84,34.06 20.9,32.99 24.26,32.99 26.16,34.9 27.84,34.9 28.22,35.28 v30.58,35.28 | v36.98,33.45 40.34,30.1 43.61,30.1 45.9,27.81 45.9,25.38 42.24,21.72 42.24,18.52 40.64,16.92 v40.64,14.63
  Bottom 0.152: v15.34,44.73 15.49,44.73 19.84,40.39 v19.84,34.9 | v30.58,35.28 35.15,35.28 v36.98,33.45 | v40.64,14.63 38.12,12.12 38.12,4.65 36.6,3.12 17.17,3.12 15.27,5.03 X7.1
N$54  (via drill 0.35)
  Top 0.152: v23.34,44.73 21.59,44.73 20.75,45.57 20.75,47.32 24.71,51.28 24.71,52.58 24.49,52.81 23.72,52.81 IC1.10 | v32.26,45.03 34.24,45.03 v34.39,44.88 | v43.84,34.52 47.27,31.09 v47.27,21.64 | v38.43,4.04 37.52,4.04 36.6,3.12 19.76,3.12 15.27,7.62 X7.2
  Bottom 0.152: v23.34,44.73 26.85,44.73 27.15,45.03 v32.26,45.03 | v34.39,44.88 41.55,37.72 41.71,37.72 43.84,35.59 v43.84,34.52 | v47.27,21.64 47.27,20.27 45.44,18.44 45.44,14.48 38.43,7.47 v38.43,4.04
N$55
  Top 0.152: R3.2 29.29,25.45 29.29,29.11 29.21,29.18 IC4.5
N$56  (via drill 0.35)
  Top 0.152: v28.75,52.12 28.75,52.88 27.23,54.41 26.62,54.41 26.31,54.1 26.31,53.49 26.62,53.19 26.62,50.44 IC1.16 | v20.75,42.75 20.75,41.61 21.97,40.39 v21.97,38.48
  Bottom 0.152: v28.75,52.12 28.3,52.12 22.58,46.41 21.13,46.41 20.75,46.03 v20.75,42.75 | v21.97,38.48 24.56,35.89 24.56,25.91 22.89,24.23 22.89,21.49 22.43,21.03 22.43,19.89 X7.4
N$57  (via drill 0.35)
  Top 0.152: v26.92,53.8 27.15,53.57 27.15,50.44 IC1.17 | v27.23,66.22 v28.37,65.08
  Bottom 0.152: v26.92,53.8 26.92,55.4 28.37,56.84 v28.37,65.08 | v27.23,66.22 18.31,66.22 16.1,68.43 6.35,68.43 1.32,63.4 1.32,23.62 5.51,19.43 5.51,12.65 6.5,11.66 11.61,11.66 15.19,15.24 X7.5
N$58  (via drill 0.35)
  Top 0.152: v22.96,51.13 23.65,51.82 IC1.12 | v17.86,37.95 v17.86,41.45 | v17.86,27.74 20.14,25.45 R10.2 20.14,25.38 19.61,24.84 v19.61,21.95
  Bottom 0.152: v22.96,51.13 15.72,51.13 13.67,53.19 13.67,53.49 13.13,54.03 12.29,54.03 11.23,52.96 11.23,44.81 12.45,43.59 15.72,43.59 v17.86,41.45 | v17.86,27.74 v17.86,37.95 | v19.61,21.95 15.49,17.83 15.27,17.83 X7.6
N$59  (via drill 0.35)
  Top 0.152: v24.41,37.8 24.26,37.8 22.28,39.78 22.28,41.53 22.43,41.68 23.27,41.68 23.95,42.37 23.95,47.93 25.17,49.15 25.17,50.37 IC1.13 | v25.48,33.3 25.02,33.3 23.5,31.77 21.59,31.77 IC4.3 | v18.92,23.47 18.92,25.22 v18.77,25.38
  Bottom 0.152: v24.41,37.8 24.41,36.96 25.48,35.89 v25.48,33.3 | v18.92,23.47 18.54,23.47 15.42,20.34 15.27,20.34 X7.7 | v18.77,25.38 18.77,25.76 19.99,26.97 19.99,30.1 21.59,31.7 IC4.3
N$60  (via drill 0.35)
  Top 0.152: v27.46,44.43 27.46,47.17 26.24,48.39 26.24,50.37 IC1.15 | v28.83,43.51 28.83,43.36 v27.99,42.52
  Bottom 0.152: v27.46,44.43 27.92,44.43 v28.83,43.51 | v27.99,42.52 27.99,37.57 27.23,36.8 27.23,33.76 29.21,31.77 IC4.6
N$61
  Top 0.152: IC1.14 25.63,50.37 25.63,49.15 24.49,48.01 24.49,42.14 24.94,41.68 25.78,41.68 29.44,38.02 33.78,38.02 34.62,37.19 34.62,36.5 33.33,35.2 31.95,35.2 31.42,34.67 31.42,31.39 32.72,30.1 34.09,30.1 34.62,29.57 34.62,28.88 33.63,27.89 31.8,27.89 30.43,26.52 30.43,24.38 30.28,24.23 27.69,24.23 26.54,25.38 R3.1
N$62
  Bottom 0.152: K1.5 29.13,20.42 29.13,19.2 34.24,14.1 34.24,6.4 RS-232-2.3
N$63
  Top 0.152: R10.1 22.96,25.45 22.96,27.81 21.59,29.18 IC4.4
N$64
  Top 0.152: R7.1 32.94,15.24 32.94,16.99 34.62,18.67 34.62,21.95 33.33,23.24 31.95,23.24 31.42,23.77 31.42,27.05 31.95,27.58 37.74,27.58 39.57,25.76 43.23,25.76 S3.5
N$65
  Top 0.152: LED3.A 47.5,58.52 47.5,53.95 45.21,51.66 45.21,51.59 41.94,48.31 41.78,48.31 R11.1
N$66  (via drill 0.35)
  Top 0.152: v14.96,41.22 14.96,41.3 15.49,41.83 17.09,41.83 17.47,42.22 17.47,47.32 18.31,48.16 19.07,48.16 20.52,49.61 20.52,49.91 22.96,52.35 23.65,52.35 IC1.11 | v18.92,29.79 20.22,29.79 20.52,30.1 22.66,30.1 24.11,28.65 24.11,21.79 23.11,20.8 23.11,17.53 25.02,15.62 v25.02,11.66
  Bottom 0.152: v14.96,41.22 15.49,41.22 18.92,37.8 v18.92,29.79 | v25.02,11.66 16.71,11.66 15.27,10.21 X7.3
N$67
  Top 0.152: X4.4 47.27,9.75 46.43,9.75 46.05,10.13 46.05,14.33 49.48,17.75 SV3.1
N$68
  Top 0.152: SV3.2 45.75,16.54 45.75,9.6 46.43,8.92 47.27,8.92 X4.3
N$69
  Top 0.152: SV3.3 44.45,10.13 46.43,8.15 47.27,8.15 X4.2
N$70  (via drill 0.35)
  Top 0.152: v21.36,43.43 21.59,43.21 22.66,43.21 C1.1 | 28.64,44.69 29.06,45.11 29.06,46.94 R2.1 | 28.64,44.69 v27.15,43.21 | v34.24,41.38 35.61,41.38 37.06,39.93 R12.1 38.66,39.93 39.42,40.69 v39.95,40.69 | 28.64,44.69 v28.9,44.43 | v10.16,70.87 6.35,67.06 X3.2 | v43.61,72.85 45.44,71.02 45.44,68.66 40.95,64.16 40.87,64.16 39.12,62.41 39.12,58.67 38.73,58.29 37.21,58.29 36.98,58.06 36.98,51.28 37.36,50.9 v37.36,50.29
  Bottom 0.152: X3.2 6.35,67.06 7.95,67.06 9.02,68.12 10.31,68.12 15.88,62.56 S4.4 | v21.36,43.43 26.92,43.43 v27.15,43.21 | v34.24,41.38 31.95,41.38 v28.9,44.43 | v10.16,70.87 20.45,70.87 22.73,73.15 40.41,73.15 40.72,73.46 43,73.46 v43.61,72.85 | v37.36,50.29 37.36,49.45 36.45,48.54 36.45,46.33 36.6,46.18 36.6,44.04 v39.95,40.69
N$71  (via drill 0.35)
  Top 0.152: F1.1 49.86,36.58 49.63,36.8 47.19,36.8 C11.1 47.12,36.88 v45.67,36.88 | v18.39,44.65 19.15,45.41 19.15,46.94 C12.1 | v23.5,23.93 22.58,23.93 D1.C | v43.61,38.86 43.61,38.18 42.24,36.8 v42.24,36.04 | v31.34,36.12 31.34,36.65 30.28,37.72 v25.78,37.72
  Bottom 0.152: v18.39,44.65 18.39,42.98 23.53,37.83 | 23.53,37.83 23.8,37.57 23.8,37.11 24.87,36.04 24.87,25.3 v23.5,23.93 | v45.67,36.88 43.69,38.86 v43.61,38.86 | v42.24,36.04 41.78,36.04 41.17,35.43 35.46,35.43 35,35.89 31.57,35.89 v31.34,36.12 | v25.78,37.72 25.4,37.72 24.71,38.41 24.11,38.41 23.53,37.83
VCC  (via drill 0.35)
  Top 0.152: Q1.4 35.61,59.51 35.61,57.3 Q1.1 35.61,57.23 35.61,56.54 v36.37,55.78 36.37,54.48 36.53,54.33 36.53,52.35 34.39,50.22 v33.93,50.22 | v41.48,61.57 41.71,61.8 41.71,63.02 C9.1 | v43.92,58.37 43.92,57.61 44.45,57.07 C7.1 | v16.71,36.2 16.71,35.66 | 16.71,35.66 16.71,34.06 16.94,33.83 17.02,33.83 17.78,33.07 JMP3.2 | v13.51,39.4 13.51,40.01 12.75,40.77 R8.1 | v33.02,39.09 31.5,40.62 C21.1 | 16.71,35.66 18.77,35.66 18.92,35.51 22.66,35.51 22.96,35.2 27.23,35.2 v27.84,35.81
  Bottom 0.152: v41.48,61.57 41.48,60.81 43.42,58.86 | v43.92,58.37 43.42,58.86 | v36.37,55.78 37.52,55.78 38.12,55.17 39.73,55.17 43.42,58.86 | v13.51,39.4 v16.71,36.2 | 33.02,38.79 35.38,36.42 35.38,36.04 35.69,35.74 36.6,35.74 | 36.6,35.74 39.57,35.74 40.64,36.8 IC3.16 | v27.84,35.81 30.12,35.81 31.42,37.11 31.42,37.19 33.02,38.79 | 33.02,38.79 v33.02,39.09 | v33.93,50.22 33.93,45.34 33.78,45.19 33.78,43.66 36.6,40.84 36.6,35.74
VDD  (via drill 0.35)
  Top 0.3: v30.89,54.33 32.11,54.33 IC1.30 | IC2.4 38.12,47.32 35.53,47.32 IC2.3 35.38,47.24 35.15,47.02 31.95,47.02 R2.2 | 40.22,54.98 39.34,54.1 39.34,48.08 38.66,47.4 38.28,47.4 IC2.4 | 40.22,54.98 41.86,56.62 41.86,57 C2.1 | IC2.4 38.28,47.24 38.28,43.36 C14.1 38.28,43.21 41.71,43.21 C15.1 41.86,43.05 43,41.91 45.97,41.91 47.19,43.13 49.4,43.13 SV1.2 49.56,43.13 52.68,40.01 52.68,36.58 F1.2 52.76,36.5 v52.76,23.32 | 40.22,54.98 v39.42,55.78 | 13.89,37.95 16.33,35.51 16.33,32.61 17.55,31.39 17.78,31.39 JMP3.1 17.86,31.39 v19.53,31.39 | 13.89,37.95 12.75,37.95 R8.2 | IC1.7 23.65,54.33 22.73,54.33 19.07,50.67 C3.1 18.92,50.67 16.56,50.67 C4.1 | v15.72,52.05 15.72,51.44 16.41,50.75 C4.1 | 13.89,37.95 13.97,38.02 13.97,38.86 14.2,39.09 14.2,47.93 16.49,50.22 16.49,50.52 C4.1 | 43.16,9.6 43.16,7.7 44.45,6.4 POWER.2 44.53,6.48 45.29,7.24 47.27,7.24 X4.1 | 43.16,9.6 TP2.TP | v23.42,36.12 23.72,36.12 25.1,37.49 25.1,40.62 C5.1 | 43.16,9.6 21.89,9.6 19.68,11.81 19.68,18.67 15.49,22.86 X7.8
  Bottom 0.3: v30.89,54.33 30.89,55.93 35.08,60.12 | 35.08,60.12 36.83,61.87 SPI.7 | v39.42,55.78 35.08,60.12 | v15.72,52.05 13.36,54.41 11.68,54.41 8.1,50.83 7.64,50.83 X5.8 | v23.42,36.12 23.42,34.06 22.12,32.77 20.52,32.77 19.61,31.85 19.61,31.39 | 19.61,31.39 19.61,27.2 15.27,22.86 X7.8 | v19.53,31.39 19.61,31.39 | v52.76,23.32 48.11,18.67 48.11,10.06 44.45,6.4 POWER.2
VSS  (via drill 0.35)
  Top 0.3: POWER.1 41.86,6.33 39.42,6.33 RS-232-2.1 39.27,6.25 38.89,6.25 37.21,4.57 30.96,4.57 29.21,6.33 RS232-1.1 | 15.27,30.48 15.27,30.17 17.09,28.35 17.09,27.28 15.27,25.45 X7.9 15.65,25.68 18.92,22.4 18.92,21.64 v19.61,20.95 | 15.27,30.48 15.27,31.32 JMP2.1 | 15.27,30.48 11.68,30.48 11.46,30.71 11.46,32.54 12.68,33.76 12.68,34.37 R9.2 | K1.8 21.51,20.42 22.5,19.43 22.5,14.94 21.97,14.4 21.97,11.43 C18.2 22.05,11.35 23.04,10.36 29.67,10.36 30.28,10.97 | 30.28,10.97 30.73,11.43 C17.2 32.18,11.35 32.18,10.82 32.94,10.06 39.57,10.06 41.94,12.42 41.94,15.16 C6.2 42.09,15.24 42.09,17.75 45.29,20.95 47.57,20.95 48.11,21.49 | v30.2,11.05 30.28,10.97 | S4.6 12.75,64.77 14.96,66.98 15.88,66.98 S4.2 | v24.11,39.4 23.19,40.31 23.19,40.62 C5.2 | v26.62,41.76 26.62,42.06 25.55,43.13 C1.2 | v16.41,45.49 16.41,46.94 C12.2 | v29.44,55.02 31.19,55.02 31.34,54.86 32.11,54.86 IC1.31 | v25.02,54.41 24.56,54.86 23.8,54.86 IC1.6 23.65,54.86 20.45,54.86 19.07,53.49 C3.2 18.92,53.49 16.56,53.49 C4.2 16.41,53.42 16.1,53.42 15.04,52.35 15.04,49.45 v13.51,47.93 | 34.92,55.93 34.47,56.39 34.47,59.05 32.87,60.66 32.87,64.39 36.14,67.67 37.44,67.67 39.34,69.57 39.34,69.8 SPI.8 | 34.92,55.93 35.38,55.47 35.38,53.34 C13.2 | 45.67,61.8 49.1,61.8 SV2.1 | 45.67,61.8 44.3,61.8 42.39,59.89 41.94,59.89 C2.2 | IC2.1 35.53,49.15 35.53,48.31 IC2.2 35.61,48.23 v37.06,48.23 | LED3.C 51.08,58.52 51.08,54.1 51.38,53.8 51.38,47.55 49.56,45.72 SV1.3 49.4,45.64 49.02,45.64 46.58,43.21 44.6,43.21 C15.2 44.53,43.28 40.64,47.17 40.64,49.3 41.78,50.44 C16.2 41.86,53.42 44.15,55.7 45.29,55.7 45.67,56.08 45.67,61.8
  Top 0.3: X4.5 47.35,10.52 47.8,10.52 48.95,11.66 48.95,12.04 52.22,15.32 52.76,15.32 TP1.TP 52.15,15.39 52.15,16.76 50.62,18.29 50.62,18.97 48.11,21.49 | 48.11,21.49 50.7,24.08 S3.2 50.62,24.23 50.62,28.73 48.49,30.86 S3.6 48.41,31.01 44.37,35.05 44.37,36.8 C11.2 44.3,36.96 44.3,39.7 42.62,41.38 37.9,41.38 36.14,43.13 35.46,43.13 C14.2 | 34.92,55.93 v34.7,55.7
  Bottom 0.3: D1.A 28.9,21.64 28.14,20.88 28.14,17.68 30.12,15.7 30.12,11.05 | 30.12,11.05 30.12,7.39 29.21,6.48 RS232-1.1 | X7.9 12.75,27.89 7.64,27.89 X6.10 | v19.61,20.95 20.9,20.95 21.44,20.42 K1.8 | v30.2,11.05 30.12,11.05 | 8.25,65 8.86,65 S4.6 | 8.25,65 6.35,65 X3.1 | 9.47,55.47 7.64,53.65 7.64,53.34 X5.9 | 9.47,55.47 9.47,60.88 8.25,62.1 8.25,65 | v26.62,41.76 24.26,39.4 v24.11,39.4 24.03,39.47 23.04,39.47 20.07,42.44 20.07,44.5 18.92,45.64 16.87,45.64 16.71,45.49 v16.41,45.49 16.33,45.57 16.03,45.57 13.67,47.93 v13.51,47.93 | 9.47,55.47 9.55,55.4 24.03,55.4 v25.02,54.41 26.31,53.11 27.23,53.11 29.13,55.02 v29.44,55.02 29.52,54.94 29.52,54.71 30.58,53.65 31.34,53.65 33.4,55.7 v34.7,55.7 | v37.06,48.23 46.43,48.23 48.95,45.72 SV1.3 49.63,45.64 49.63,45.41 51.38,43.66 51.38,33.91 48.49,31.01 S3.6 | SPI.8 39.42,69.8 39.65,69.8 47.19,62.26 49.48,62.26 SV2.1

### Text on the board
Top: 1.7 FGB@MCHP | these are the controllers you are looking for
200bmp: /fred/Downloads/mchp.bmp